# EAGLE design 12vand9v (EAGLE 7.2.0)
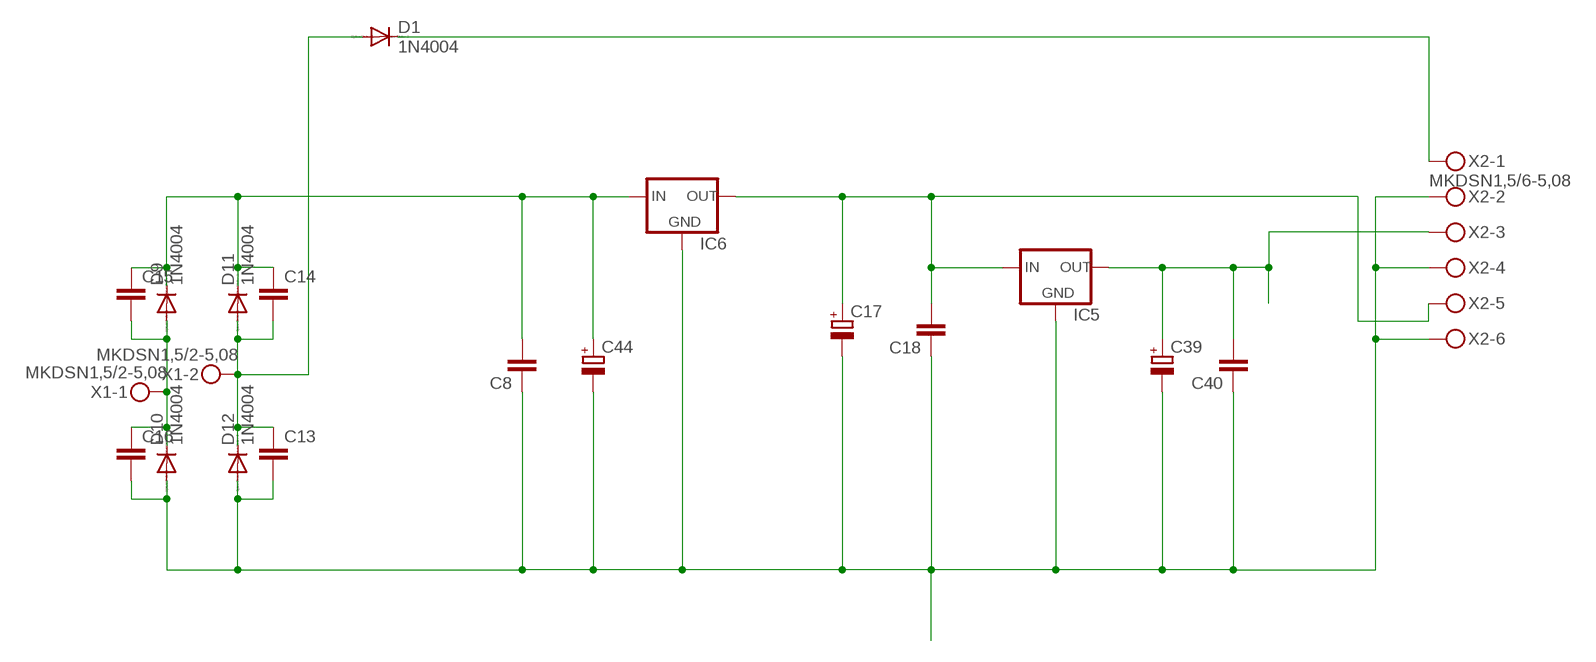
[diagram p0: schematic, sheet 1]

## Parts
C8  C-EU050-045X075  [C050-045X075]
C13  C-EU025-025X050  [C025-025X050]
C14  C-EU025-025X050  [C025-025X050]
C15  C-EU025-025X050  [C025-025X050]
C16  C-EU025-025X050  [C025-025X050]
C17  CPOL-EUE5-10.5  [E5-10,5]
C18  C-EU050-045X075  [C050-045X075]
C39  CPOL-EUE5-10.5  [E5-10,5]
C40  C-EU050-045X075  [C050-045X075]
C44  CPOL-EUE7.5-18  [E7,5-18]
D1  1N4004  [DO41-10]
D9  1N4004  [DO41-10]
D10  1N4004  [DO41-10]
D11  1N4004  [DO41-10]
D12  1N4004  [DO41-10]
IC5  78XXS  [78XXS]
IC6  78XXS  [78XXS]
X1  MKDSN1,5/2-5,08  [MKDSN1,5/2-5,08]
X2  MKDSN1,5/6-5,08  [MKDSN1,5/6-5,08]

## Nets
GND: C8.1 C13.2 C16.2 C17.- C18.1 C39.- C40.1 C44.- D10.A D12.A IC5.GND IC6.GND X2.2 X2.4 X2.6
N$1: D1.C X2.1
N$3: C39.+ C40.2 IC5.OUT X2.3
N$11: C8.2 C14.1 C15.1 C44.+ D9.C D11.C IC6.IN
N$12: C15.2 C16.1 D9.A D10.C X1.1
N$14: C13.1 C14.2 D1.A D11.A D12.C X1.2
N$24: C17.+ C18.2 IC5.IN IC6.OUT X2.5

## Library data of the parts
C8 C13-C16 C18 C40 = Vwvwbg:C-EU: CAPACITOR, European symbol
C17 C39 C44 = Vwvwbg:CPOL-EU: POLARIZED CAPACITOR, European symbol
D1 D9-D12 = diode:1N4004: DIODE general purpose rectifier, 1 A
IC5 IC6 = v-reg:78XXS: VOLTAGE REGULATOR
X1 = con-phoenix-508:MKDSN1,5/2-5,08: MKDSN 1,5/ 2-5,08 Printklemme Nennstrom: 13,5 A Nennspannung: 250 V Rastermaß: 5,08 mm Polzahl: 2 Anschlussart: Schraubanschluss Montage: Löten Anschlussrichtung Leiter/Platine: 0 ° Artikelnummer: 1729128 Source: http://eshop.phoenixcontact.com .. 1729128.pdf
X2 = con-phoenix-508:MKDSN1,5/6-5,08: MKDSN 1,5/ 6-5,08 Printklemme Nennstrom: 13,5 A Nennspannung: 250 V Rastermaß: 5,08 mm Polzahl: 6 Anschlussart: Schraubanschluss Montage: Löten Anschlussrichtung Leiter/Platine: 0 ° Artikelnummer: 1729160 Source: http://eshop.phoenixcontact.com .. 1729160.pdf

## Board
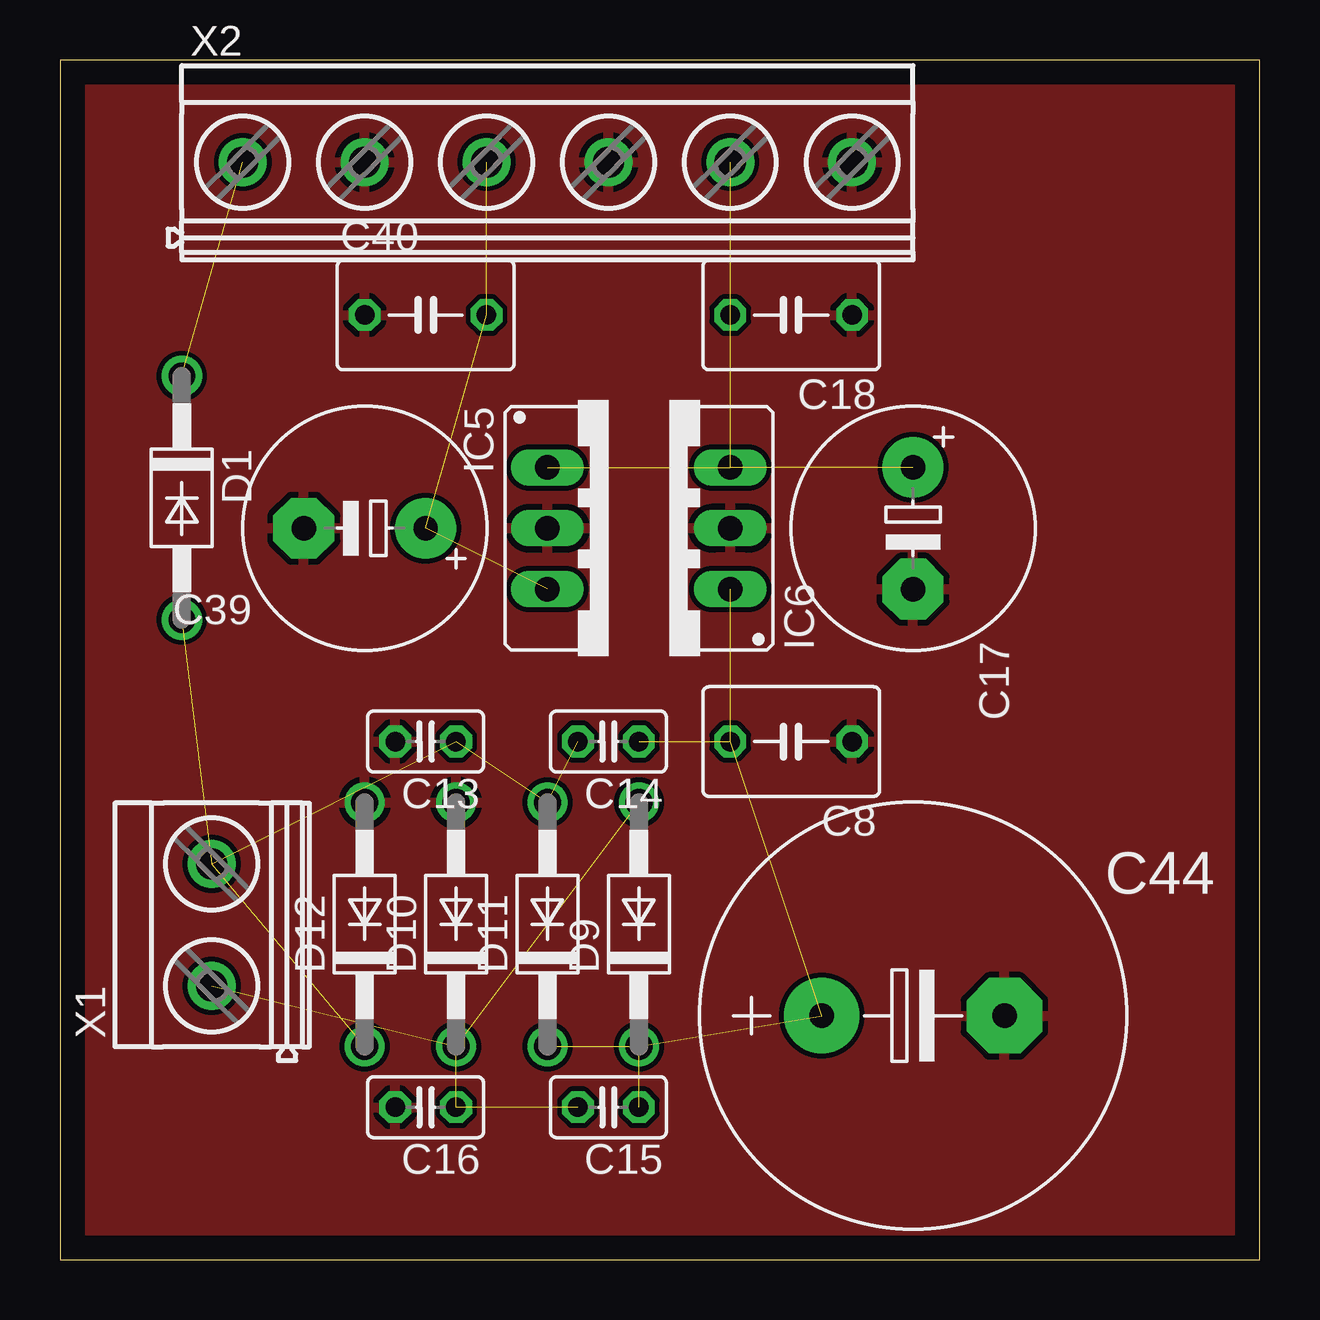
[diagram p1: board, top side]
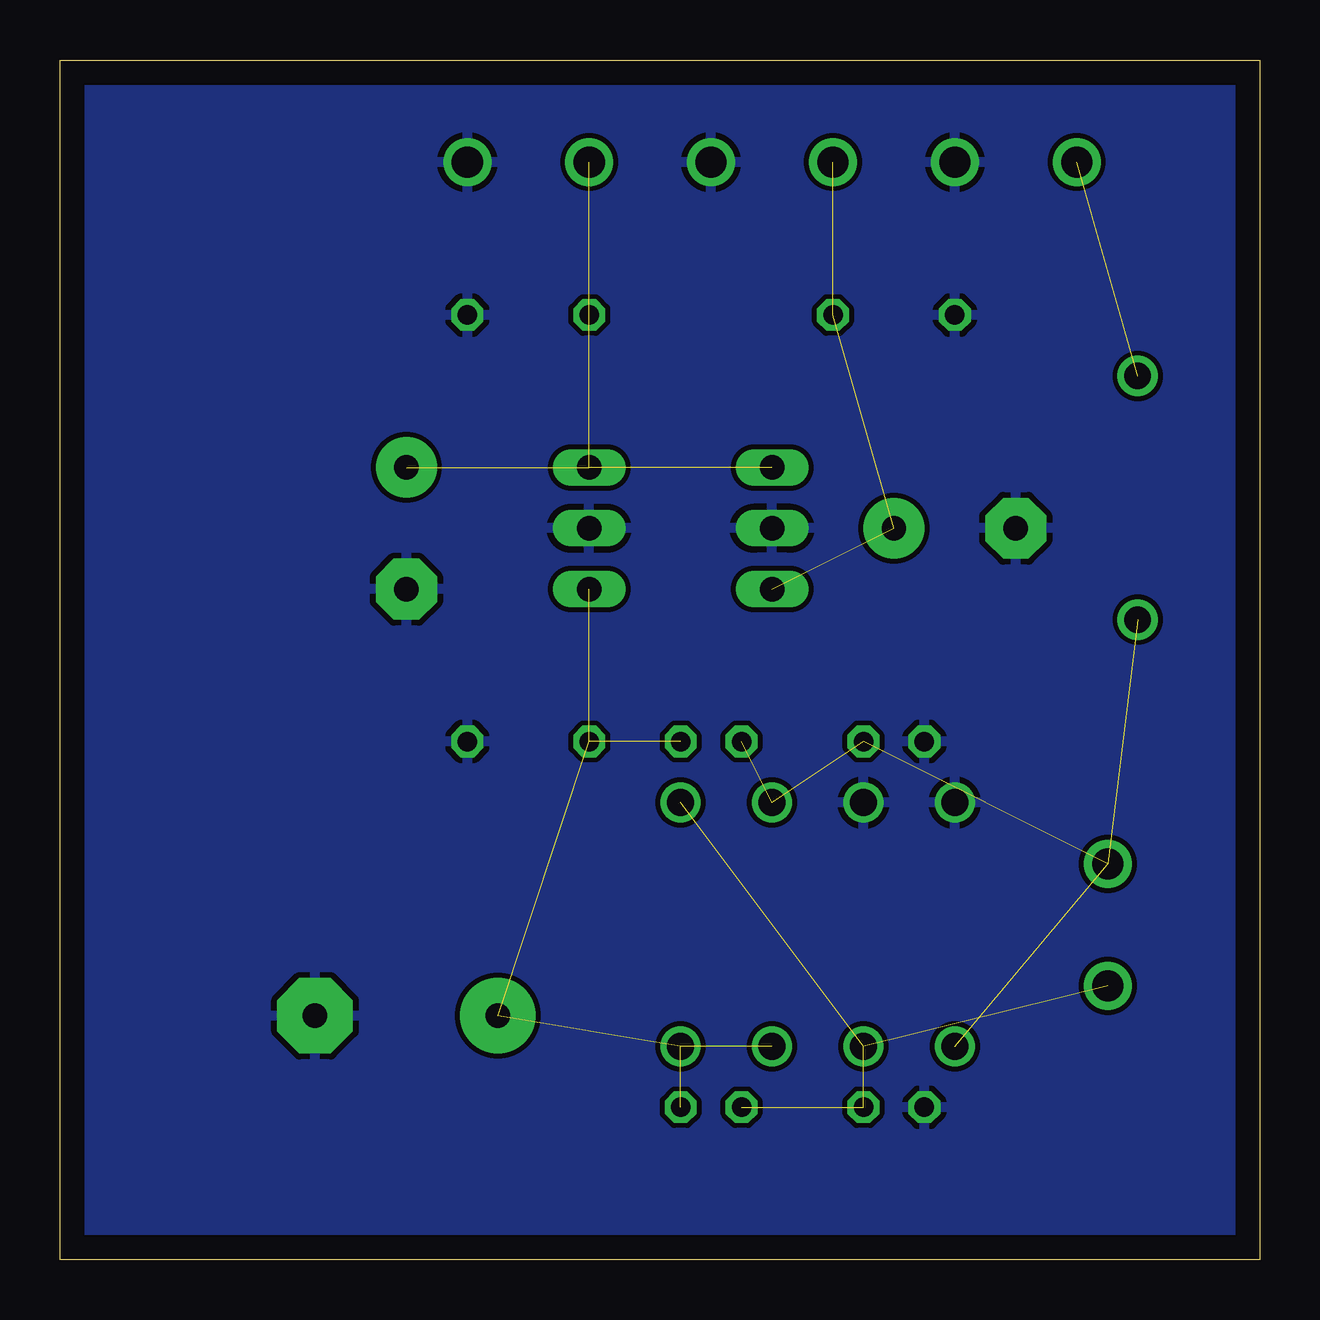
[diagram p2: board, bottom side, seen from below]

Size 50 x 50 mm. Coordinates in mm from the lower left corner, seen from the top.
Outline: 0,0 50,0 50,50 0,50 0,0
Copper layers (1*16): Top 0.035mm / dielectric 1.5mm / Bottom 0.035mm
Design rules "default": minimum track width 10mil, minimum drill 24mil, track to track 8mil, track to pad 8mil, pad to pad 8mil, via to via 8mil, smd to smd 8mil, copper to edge 40mil, drill to drill 8mil, minimum pad ring 10mil, minimum via ring 8mil, stop-mask expansion 4mil, vias tented up to drill 0mil, thermal gap 10mil

### Footprints (pad centres in the part's own frame; a part is rotated, then mirrored left to right if it is on the bottom)
C050-045X075 = drill 0.813 octagon: 1 -2.54,0; 2 2.54,0
C025-025X050 = drill 0.813 octagon: 1 -1.27,0; 2 1.27,0
E5-10,5 = drill 1.016 pad 2.54: + -2.54,0 | drill 1.016 pad 2.54 octagon: - 2.54,0
E7,5-18 = drill 1.016 pad 3.15: + -3.81,0 | drill 1.016 pad 3.15 octagon: - 3.81,0
DO41-10 = drill 1.118: A 5.08,0; C -5.08,0
78XXS = drill 1.016 long: GND 0,-2.54; IN -2.54,-2.54; OUT 2.54,-2.54
MKDSN1,5/2-5,08 = drill 1.3 pad 2: 1 -2.561,0.025; 2 2.519,0.025
MKDSN1,5/6-5,08 = drill 1.3 pad 2: 1 -12.7,0.025; 2 -7.62,0.025; 3 -2.54,0.025; 4 2.54,0.025; 5 7.62,0.025; 6 12.7,0.025

### Placement (x,y rotation side)
C8  30.48,21.59 180 top
C13  15.24,21.59 180 top
C14  22.86,21.59 180 top
C15  22.86,6.35 180 top
C16  15.24,6.35 180 top
C17  35.56,30.48 270 top
C18  30.48,39.37 180 top
C39  12.7,30.48 180 top
C40  15.24,39.37 0 top
C44  35.56,10.16 0 top
D1  5.08,31.75 270 top
D9  24.13,13.97 90 top
D10  16.51,13.97 90 top
D11  20.32,13.97 90 top
D12  12.7,13.97 90 top
IC5  22.86,30.48 270 top
IC6  25.4,30.48 90 top
X1  6.35,13.97 90 top
X2  20.32,45.72 0 top

### Tracks (layer width: path | path; a pad name or v marks a point on that pad's centre or on a via)
GND
  pour Bottom: 0,49.53 0,0 50.8,0 50.8,50.8 0,50.8
  pour Top: -1.27,52.07 -1.27,-2.54 53.34,-2.54 53.34,52.07
N$1  (1 unrouted)
N$3  (3 unrouted)
N$11  (6 unrouted)
N$12  (4 unrouted)
N$14  (5 unrouted)
N$24  (4 unrouted)